# Altium schematic sheet AS_Node_Voltage_Regulators.SchDoc
size A4
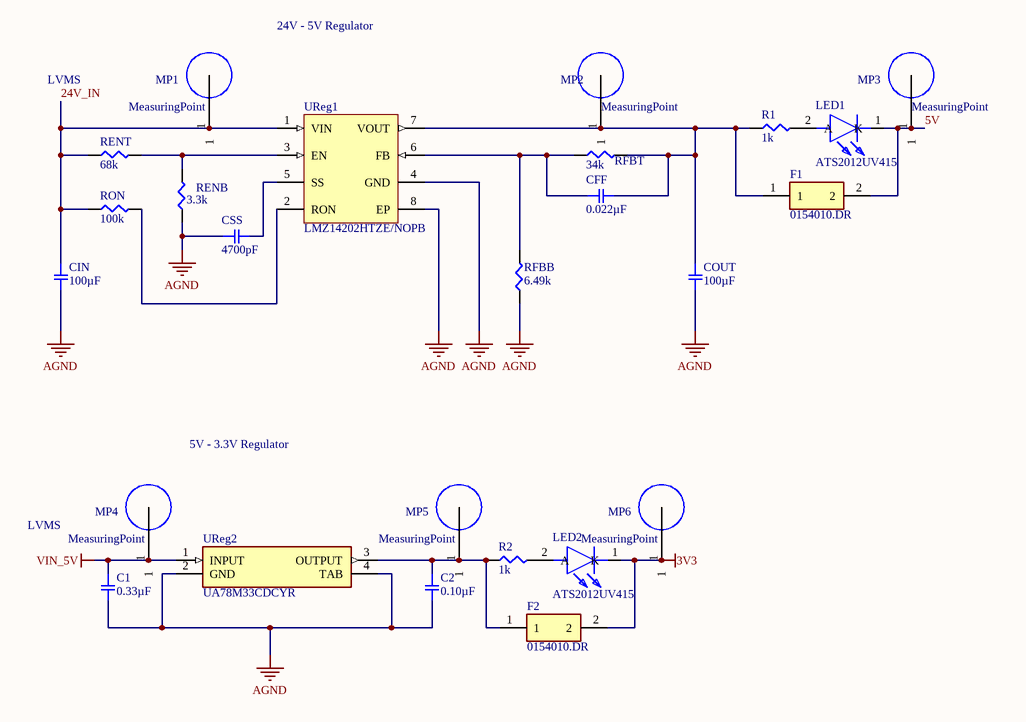
[diagram p0: AS_Node_Voltage_Regulators.SchDoc]

## Parts
C1  0.33µF  [SMD-0805C]
C2  0.10µF  [SMD-0805C]
CFF  0.022µF  [SMD-0805C]
CIN  100µF  [SMD-0805C]
COUT  100µF  [SMD-0805C]
CSS  4700pF  [SMD-0805C]
F1  0154010.DR  [0154001.DRT]
F2  0154010.DR  [0154001.DRT]
LED1  ATS2012UV415  [ATS2012UV415]
LED2  ATS2012UV415  [ATS2012UV415]
MP1  MeasuringPoint  [MeasuringPoint]
MP2  MeasuringPoint  [MeasuringPoint]
MP3  MeasuringPoint  [MeasuringPoint]
MP4  MeasuringPoint  [MeasuringPoint]
MP5  MeasuringPoint  [MeasuringPoint]
MP6  MeasuringPoint  [MeasuringPoint]
R1  1k  [SMD-0805-RES]
R2  1k  [SMD-0805-RES]
RENB  3.3k  [SMD-0805-RES]
RENT  68k  [SMD-0805-RES]
RFBB  6.49k  [SMD-0805-RES]
RFBT  34k  [SMD-0805-RES]
RON  100k  [SMD-0805-RES]
UReg1  LMZ14202HTZE/NOPB  [NDW0007A_V]
UReg2  UA78M33CDCYR  [SOT230P700X180-4N]

## Nets
3V3: F2.2 LED2.1(K) MP6.1
AGND: C1.2 C2.2 CIN.2 COUT.2 CSS.1 RENB.1 RFBB.1 UReg1.4(GND) UReg1.8(EP) UReg2.2(GND) UReg2.4(TAB)
VIN_5V: C1.1 MP4.1 UReg2.1(INPUT)
5V: F1.2 LED1.1(K) MP3.1
24V_IN: CIN.1 MP1.1 RENT.1 RON.1 UReg1.1(VIN)
NetC2_1: C2.1 F2.1 MP5.1 R2.1 UReg2.3(OUTPUT)
NetCFF_1: CFF.1 RFBB.2 RFBT.1 UReg1.6(FB)
NetCFF_2: CFF.2 COUT.1 F1.1 MP2.1 R1.1 RFBT.2 UReg1.7(VOUT)
NetCSS_2: CSS.2 UReg1.5(SS)
NetLED1_2: LED1.2(A) R1.2
NetLED2_2: LED2.2(A) R2.2
NetRENB_2: RENB.2 RENT.2 UReg1.3(EN)
NetRON_2: RON.2 UReg1.2(RON)

## Notes on the sheet
- 24V - 5V Regulator
- LVMS
- 5V - 3.3V Regulator

## Library data of the parts
C1 = GCM21BL81H334KA56L: CAP CER 0.33UF 50V X8L 0805; Manufacturer: Murata Electronics North America; Factory Stock: 0; Unit Price (USD): 0.41; Minimum Quantity: 1; Tolerance: ±10%; Value: 0.33µF; Datasheets: http://www.murata.com/~/media/webrenewal/support/library/catalog/products/capacitor/mlcc/c03e.ashx; Image: //media.digikey.com/photos/Murata%20Photos/NCP,GCM%20SERIES%200805.jpg; Digi-Key Part Number: 490-11962-1-ND; Part Number: GCM21BL81H334KA56L; Quantity Available: 2723; @ qty: 0; Packaging: Cut Tape (CT); Series: GCM; Part Status: Active; Voltage: 50V; Temperature Coefficient: X8L; Operating Temperature: -55°C ~ 150°C; Features: -; Ratings: AEC-Q200; Applications: Automotive; Mounting Type: Surface Mount, MLCC; Package / Case: 0805 (2012 Metric); Size / Dimension: 0.079" L x 0.049" W (2.00mm x 1.25mm); Height - Seated (Max): -; Thickness (Max): 0.055" (1.40mm); Lead Spacing: -; Lead Style: -
C2 = GCD21BR71H104KA01L: CAP CER 0.1UF 50V X7R 0805; Manufacturer: Murata Electronics North America; Factory Stock: 0; Unit Price (USD): 0.24; Minimum Quantity: 1; Tolerance: ±10%; Value: 0.10µF; Datasheets: http://www.murata.com/~/media/webrenewal/support/library/catalog/products/capacitor/mlcc/c03e.ashx; Image: //media.digikey.com/Renders/Murata%20Renders/0805%28GxM6%29.jpg; Digi-Key Part Number: 490-11955-1-ND; Part Number: GCD21BR71H104KA01L; Quantity Available: 157; @ qty: 0; Packaging: Cut Tape (CT); Series: GCD; Part Status: Active; Voltage: 50V; Temperature Coefficient: X7R; Operating Temperature: -55°C ~ 125°C; Features: -; Ratings: AEC-Q200; Applications: Automotive; Mounting Type: Surface Mount, MLCC; Package / Case: 0805 (2012 Metric); Size / Dimension: 0.079" L x 0.049" W (2.00mm x 1.25mm); Height - Seated (Max): -; Thickness (Max): 0.049" (1.25mm); Lead Spacing: -; Lead Style: -
CFF = GC321BD72E223KX03L: CAP CER 0.022UF 250V X7T 0805; Manufacturer: Murata Electronics North America; Factory Stock: 0; Unit Price (USD): 0.27; Minimum Quantity: 1; Tolerance: ±10%; Value: 0.022µF; Datasheets: http://search.murata.co.jp/Ceramy/image/img/A01X/G101/ENG/GC321BD72E223KX03-01.pdf; Image: //media.digikey.com/Renders/Murata%20Renders/0805(GC3)200x125.jpg; Digi-Key Part Number: 490-13988-1-ND; Part Number: GC321BD72E223KX03L; Quantity Available: 3000; @ qty: 0; Packaging: Cut Tape (CT); Series: GC3; Part Status: Active; Voltage: 250V; Temperature Coefficient: X7T; Operating Temperature: -55°C ~ 125°C; Features: -; Ratings: AEC-Q200; Applications: Automotive; Mounting Type: Surface Mount, MLCC; Package / Case: 0805 (2012 Metric); Size / Dimension: 0.079" L x 0.049" W (2.00mm x 1.25mm); Height - Seated (Max): -; Thickness (Max): 0.057" (1.45mm); Lead Spacing: -; Lead Style: -
CIN COUT = GRM21BC80E107ME15L: CAP CER 100UF 2.5V X6S 0805; Manufacturer: Murata Electronics North America; Factory Stock: 0; Unit Price (USD): 2.17; Minimum Quantity: 1; Tolerance: ±20%; Value: 100µF; Datasheets: http://search.murata.co.jp/Ceramy/image/img/A01X/G101/ENG/GRM21BC80E107ME15-01.pdf; Image: //media.digikey.com/Renders/Murata%20Renders/0805%20(2012%20Metric)%20.85mm.jpg; Digi-Key Part Number: 490-13977-1-ND; Part Number: GRM21BC80E107ME15L; Quantity Available: 5990; @ qty: 0; Packaging: Cut Tape (CT); Series: GRM; Part Status: Active; Voltage: 2.5V; Temperature Coefficient: X6S; Operating Temperature: -55°C ~ 105°C; Features: -; Ratings: -; Applications: General Purpose; Mounting Type: Surface Mount, MLCC; Package / Case: 0805 (2012 Metric); Size / Dimension: 0.079" L x 0.049" W (2.00mm x 1.25mm); Height - Seated (Max): -; Thickness (Max): 0.057" (1.45mm); Lead Spacing: -; Lead Style: -
CSS = GCJ21AR72E472KXJ1D: CAP CER 4700PF 250V X7R 0805; Manufacturer: Murata Electronics North America; Factory Stock: 0; Unit Price (USD): 0.3; Minimum Quantity: 1; Tolerance: ±10%; Value: 4700pF; Datasheets: http://www.murata.com/~/media/webrenewal/support/library/catalog/products/capacitor/mlcc/c03e.ashx; Image: //media.digikey.com/Renders/Murata%20Renders/0805%20(2012%20Metric)%20.85mm.jpg; Digi-Key Part Number: 490-5593-1-ND; Part Number: GCJ21AR72E472KXJ1D; Quantity Available: 1082; @ qty: 0; Packaging: Cut Tape (CT); Series: GCJ; Part Status: Active; Voltage: 250V; Temperature Coefficient: X7R; Operating Temperature: -55°C ~ 125°C; Features: Soft Termination; Ratings: AEC-Q200; Applications: Automotive, Boardflex Sensitive; Mounting Type: Surface Mount, MLCC; Package / Case: 0805 (2012 Metric); Size / Dimension: 0.079" L x 0.049" W (2.00mm x 1.25mm); Height - Seated (Max): -; Thickness (Max): 0.039" (1.00mm); Lead Spacing: -; Lead Style: -
F1 F2 = 0154010.DR: Fuse; Manufacturer_Name: LITTELFUSE; Allied_Number: 70519129; Datasheet Link: http://m.littelfuse.com/~/media/electronics/datasheets/fuses/littelfuse_fuse_154_154t_154l_154tl_datasheet.pdf.pdf; Manufacturer_Part_Number: 0154010.DR; Mouser Part Number: 576-0154010.DR; Mouser Price/Stock: https://www.mouser.com/Search/Refine.aspx?Keyword=576-0154010.DR; RS Part Number: 7382867; RS Price/Stock: https://uk.rs-online.com/web/p/products/7382867; Allied Price/Stock: https://www.alliedelec.com/littelfuse-0154010-dr/70519129/
LED1 LED2 = ATS2012UV415: LED; Manufacturer_Name: Kingbright; Datasheet Link: https://componentsearchengine.com/Datasheets/1/ATS2012UV415.pdf; Height: 1mm; Mouser2 Part Number: 604-ATS2012UV415; Mouser2 Price/Stock: https://www.mouser.com/Search/Refine.aspx?Keyword=604-ATS2012UV415; Manufacturer_Part_Number: ATS2012UV415
MP1-MP6 = MeasuringPoint: 1,2mm hole for measuring purpose. Designator should be signal name.
R1 R2 = ERJ-6ENF1001V: RES SMD 1K OHM 1% 1/8W 0805; Manufacturer: Panasonic Electronic Components; Factory Stock: 0; Unit Price (USD): 0.00729; @ qty: 1500; Minimum Quantity: 1; Power (Watts): 0.125W, 1/8W; Temperature Coefficient: ±100ppm/°C; Value: 1k; Part Number: ERJ-6ENF1001V; Datasheets: http://industrial.panasonic.com/www-cgi/jvcr13pz.cgi?E+PZ+3+AOA0002+ERJ6ENF1001V+7+WW; Image: //media.digikey.com/Renders/Panasonic%20Renders/ERJ-0805%20Pkg.jpg; Digi-Key Part Number: P1.00KCCT-ND; Quantity Available: 12895103; Packaging: Cut Tape (CT); Series: ERJ; Part Status: Active; Tolerance: ±1%; Composition: Thick Film; Features: Automotive AEC-Q200; Operating Temperature: -55°C ~ 155°C; Package / Case: 0805 (2012 Metric); Supplier Device Package: 0805; Size / Dimension: 0.079" L x 0.049" W (2.00mm x 1.25mm); Height - Seated (Max): 0.028" (0.70mm); Number of Terminations: 2; Failure Rate: -
RENB = ERJ-6ENF3301V: RES SMD 3.3K OHM 1% 1/8W 0805; Manufacturer: Panasonic Electronic Components; Factory Stock: 0; Unit Price (USD): 0.00729; @ qty: 1500; Minimum Quantity: 1; Power (Watts): 0.125W, 1/8W; Temperature Coefficient: ±100ppm/°C; Value: 3.3k; Part Number: ERJ-6ENF3301V; Datasheets: http://industrial.panasonic.com/www-cgi/jvcr13pz.cgi?E+PZ+3+AOA0002+ERJ6ENF3301V+7+WW; Image: //media.digikey.com/Renders/Panasonic%20Renders/ERJ-0805%20Pkg.jpg; Digi-Key Part Number: P3.30KCCT-ND; Quantity Available: 89456; Packaging: Cut Tape (CT); Series: ERJ; Part Status: Active; Tolerance: ±1%; Composition: Thick Film; Features: Automotive AEC-Q200; Operating Temperature: -55°C ~ 155°C; Package / Case: 0805 (2012 Metric); Supplier Device Package: 0805; Size / Dimension: 0.079" L x 0.049" W (2.00mm x 1.25mm); Height - Seated (Max): 0.028" (0.70mm); Number of Terminations: 2; Failure Rate: -
RENT = ERJ-6ENF6802V: RES SMD 68K OHM 1% 1/8W 0805; Manufacturer: Panasonic Electronic Components; Factory Stock: 0; Unit Price (USD): 0.00729; @ qty: 1500; Minimum Quantity: 1; Power (Watts): 0.125W, 1/8W; Temperature Coefficient: ±100ppm/°C; Value: 68k; Part Number: ERJ-6ENF6802V; Datasheets: http://industrial.panasonic.com/www-cgi/jvcr13pz.cgi?E+PZ+3+AOA0002+ERJ6ENF6802V+7+WW; Image: //media.digikey.com/Renders/Panasonic%20Renders/ERJ-0805%20Pkg.jpg; Digi-Key Part Number: P68.0KCCT-ND; Quantity Available: 38245; Packaging: Cut Tape (CT); Series: ERJ; Part Status: Active; Tolerance: ±1%; Composition: Thick Film; Features: Automotive AEC-Q200; Operating Temperature: -55°C ~ 155°C; Package / Case: 0805 (2012 Metric); Supplier Device Package: 0805; Size / Dimension: 0.079" L x 0.049" W (2.00mm x 1.25mm); Height - Seated (Max): 0.028" (0.70mm); Number of Terminations: 2; Failure Rate: -
RFBB = ERJ-6ENF6491V: RES SMD 6.49K OHM 1% 1/8W 0805; Manufacturer: Panasonic Electronic Components; Factory Stock: 0; Unit Price (USD): 0.00729; @ qty: 1500; Minimum Quantity: 1; Power (Watts): 0.125W, 1/8W; Temperature Coefficient: ±100ppm/°C; Value: 6.49k; Part Number: ERJ-6ENF6491V; Datasheets: http://industrial.panasonic.com/www-cgi/jvcr13pz.cgi?E+PZ+3+AOA0002+ERJ6ENF6491V+7+WW; Image: //media.digikey.com/Renders/Panasonic%20Renders/ERJ-0805%20Pkg.jpg; Digi-Key Part Number: P6.49KCCT-ND; Quantity Available: 7881; Packaging: Cut Tape (CT); Series: ERJ; Part Status: Active; Tolerance: ±1%; Composition: Thick Film; Features: Automotive AEC-Q200; Operating Temperature: -55°C ~ 155°C; Package / Case: 0805 (2012 Metric); Supplier Device Package: 0805; Size / Dimension: 0.079" L x 0.049" W (2.00mm x 1.25mm); Height - Seated (Max): 0.028" (0.70mm); Number of Terminations: 2; Failure Rate: -
RFBT = ERJ-6ENF3402V: RES SMD 34K OHM 1% 1/8W 0805; Manufacturer: Panasonic Electronic Components; Factory Stock: 0; Unit Price (USD): 0.00729; @ qty: 1500; Minimum Quantity: 1; Power (Watts): 0.125W, 1/8W; Temperature Coefficient: ±100ppm/°C; Value: 34k; Part Number: ERJ-6ENF3402V; Datasheets: http://industrial.panasonic.com/www-cgi/jvcr13pz.cgi?E+PZ+3+AOA0002+ERJ6ENF3402V+7+WW; Image: //media.digikey.com/Renders/Panasonic%20Renders/ERJ-0805%20Pkg.jpg; Digi-Key Part Number: P34.0KCCT-ND; Quantity Available: 29829; Packaging: Cut Tape (CT); Series: ERJ; Part Status: Active; Tolerance: ±1%; Composition: Thick Film; Features: Automotive AEC-Q200; Operating Temperature: -55°C ~ 155°C; Package / Case: 0805 (2012 Metric); Supplier Device Package: 0805; Size / Dimension: 0.079" L x 0.049" W (2.00mm x 1.25mm); Height - Seated (Max): 0.028" (0.70mm); Number of Terminations: 2; Failure Rate: -
RON = ERJ-6ENF1003V: RES SMD 100K OHM 1% 1/8W 0805; Manufacturer: Panasonic Electronic Components; Factory Stock: 0; Unit Price (USD): 0.00729; @ qty: 1500; Minimum Quantity: 1; Power (Watts): 0.125W, 1/8W; Temperature Coefficient: ±100ppm/°C; Value: 100k; Part Number: ERJ-6ENF1003V; Datasheets: http://industrial.panasonic.com/www-cgi/jvcr13pz.cgi?E+PZ+3+AOA0002+ERJ6ENF1003V+7+WW; Image: //media.digikey.com/Renders/Panasonic%20Renders/ERJ-0805%20Pkg.jpg; Digi-Key Part Number: P100KCCT-ND; Quantity Available: 760677; Packaging: Cut Tape (CT); Series: ERJ; Part Status: Active; Tolerance: ±1%; Composition: Thick Film; Features: Automotive AEC-Q200; Operating Temperature: -55°C ~ 155°C; Package / Case: 0805 (2012 Metric); Supplier Device Package: 0805; Size / Dimension: 0.079" L x 0.049" W (2.00mm x 1.25mm); Height - Seated (Max): 0.028" (0.70mm); Number of Terminations: 2; Failure Rate: -
UReg1 = CMP-0069-02052-2: 2A SIMPLE SWITCHER® Power Module with 42V Maximum Input, 7-pin TO-PMOD, Pb-Free, 45 Rail; Manufacturer: Texas Instruments; PowerWise: Y; PackageTopMarking: NSUZXYTTE#*LMZ14202*HTZ; PackageDescription: TO-PMOD-7, 10.16 x 9.85 x 4.57 mm Body, 7 Lead, 1.27mm Pitch, Surface Mount; ComponentLink1URL: http://www.ti.com/general/docs/lit/getliterature.tsp?genericPartNumber=LMZ14202H&fileType=pdf; RoHS: Y; ComponentLink1Description: Datasheet URL; PackageReference: NDW0007A; CompType: Switcher; PinCount: 7
UReg2 = UA78M33CDCYR: Undefined or Miscellaneous; Manufacturer_Name: Texas Instruments; Datasheet Link: http://www.ti.com/lit/gpn/ua78m; Height: 1.8mm; Manufacturer_Part_Number: UA78M33CDCYR; Mouser Part Number: 595-UA78M33CDCYR; Mouser Price/Stock: https://www.mouser.com/Search/Refine.aspx?Keyword=595-UA78M33CDCYR